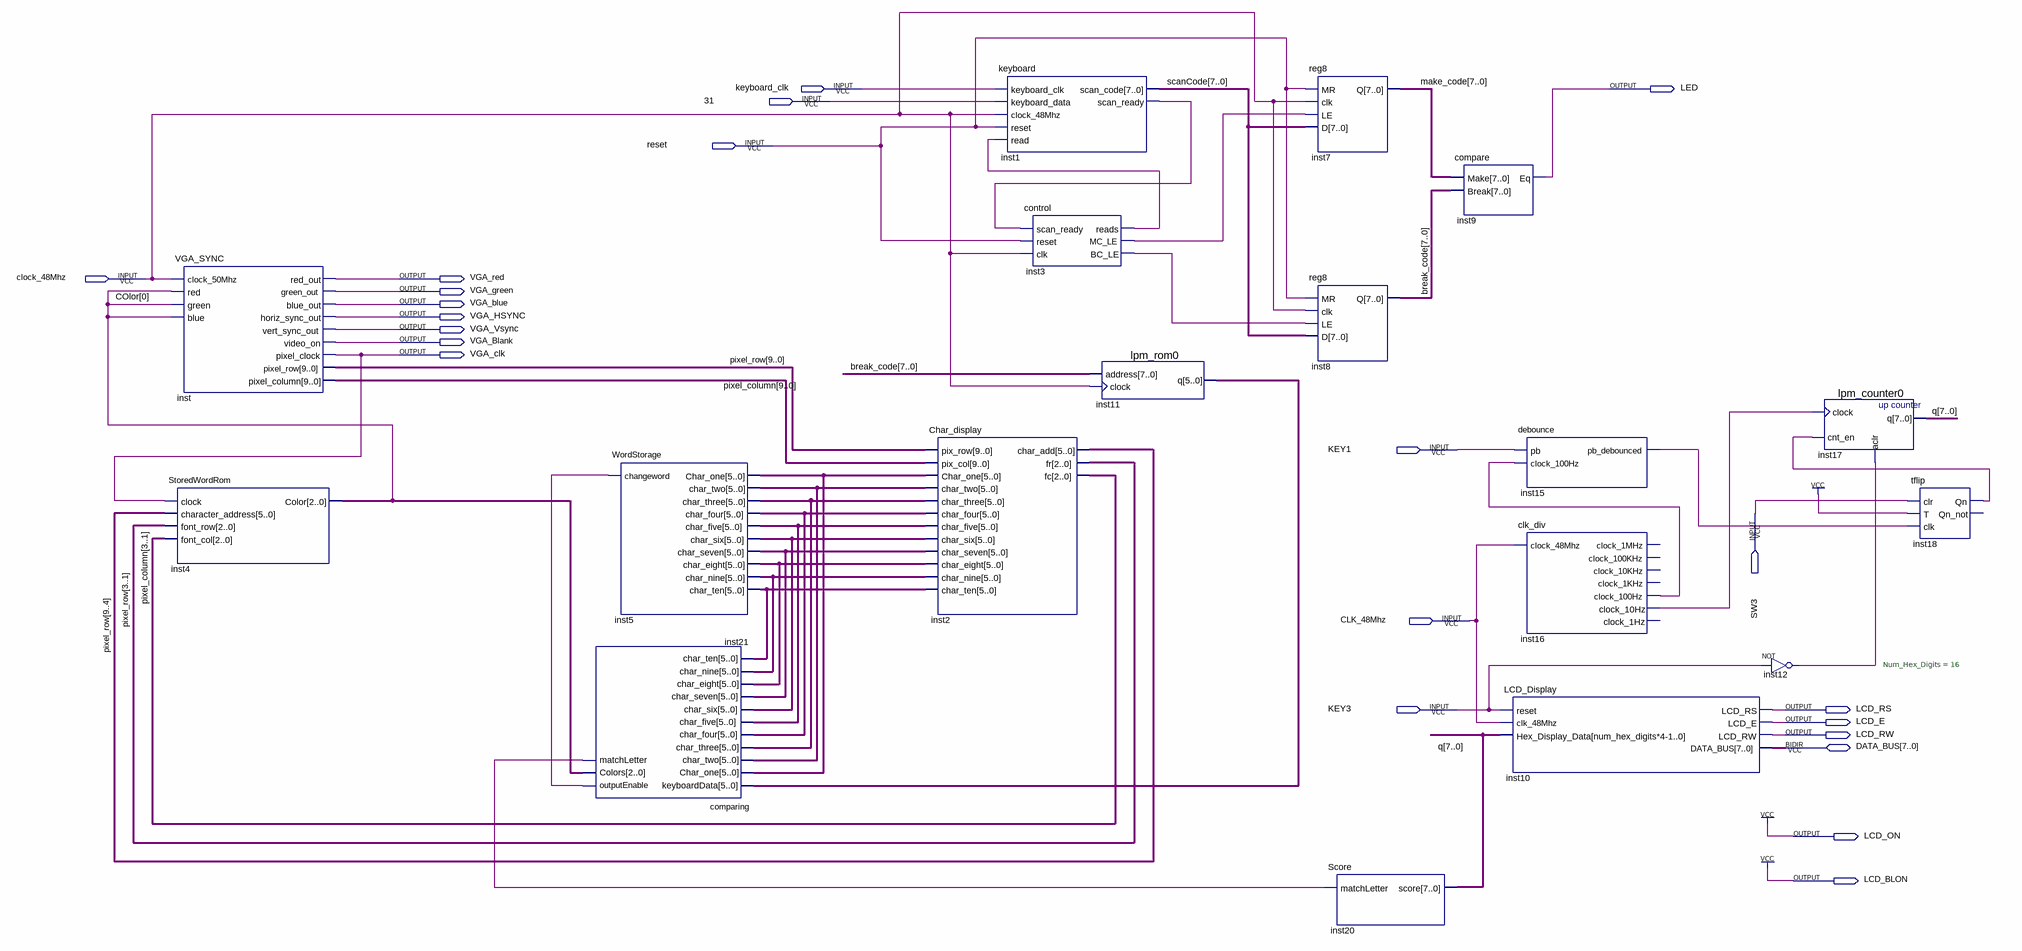
[diagram p0: schematic sheet]
// Quartus schematic overview(donotinclude).bdf as structural Verilog: 18 symbols, 22 pins
module \overview(donotinclude)  (
  input  keyboard_clk,
  input  \31 ,
  input  reset,
  input  clock_48Mhz,
  input  KEY1,
  input  SW3,
  input  CLK_48Mhz,
  input  KEY3,
  inout  [7:0] DATA_BUS,
  output LED,
  output VGA_red,
  output VGA_green,
  output VGA_blue,
  output VGA_HSYNC,
  output VGA_Vsync,
  output VGA_Blank,
  output VGA_clk,
  output LCD_RS,
  output LCD_E,
  output LCD_RW,
  output LCD_ON,
  output LCD_BLON
);

  wire inst1_scan_ready, inst3_bc_le, inst3_mc_le, inst3_reads, inst12_out, inst15_pb_debounced,
       inst16_clock_10hz, inst16_clock_100hz, inst18_qn, inst21_matchletter, inst21_outputenable;
  wire [0:0] COlor;
  wire [2:0] inst4_color;
  wire [5:0] inst5_char_eight, inst5_char_five, inst5_char_four, inst5_char_nine, inst5_char_one,
       inst5_char_seven, inst5_char_six, inst5_char_ten, inst5_char_three, inst5_char_two, inst11_q;
  wire [7:0] break_code, make_code, q, scanCode;
  wire [9:0] pixel_column, pixel_row;

  VGA_SYNC inst (
    .clock_50Mhz(clock_48Mhz), .red(COlor[0]), .green(COlor[0]), .blue(COlor[0]), .red_out(VGA_red),
    .green_out(VGA_green), .blue_out(VGA_blue), .horiz_sync_out(VGA_HSYNC), .vert_sync_out(VGA_Vsync),
    .video_on(VGA_Blank), .pixel_clock(VGA_clk), .pixel_row(pixel_row), .pixel_column(pixel_column));
  StoredWordRom inst4 (
    .clock(VGA_clk), .character_address(pixel_row[9:4]), .font_row(pixel_row[3:1]),
    .font_col(pixel_column[3:1]), .Color(inst4_color));
  WordStorage inst5 (
    .changeword(inst21_outputenable), .Char_one(inst5_char_one), .char_two(inst5_char_two),
    .char_three(inst5_char_three), .char_four(inst5_char_four), .char_five(inst5_char_five),
    .char_six(inst5_char_six), .char_seven(inst5_char_seven), .char_eight(inst5_char_eight),
    .char_nine(inst5_char_nine), .char_ten(inst5_char_ten));
  comparing inst21 (
    .keyboardData(inst11_q), .Char_one(inst5_char_one), .char_two(inst5_char_two),
    .char_three(inst5_char_three), .char_four(inst5_char_four), .char_five(inst5_char_five),
    .char_six(inst5_char_six), .char_seven(inst5_char_seven), .char_eight(inst5_char_eight),
    .char_nine(inst5_char_nine), .char_ten(inst5_char_ten), .outputEnable(inst21_outputenable),
    .Colors(inst4_color), .matchLetter(inst21_matchletter));
  Char_display inst2 (
    .pix_row(pixel_row), .pix_col(pixel_column), .Char_one(inst5_char_one), .char_two(inst5_char_two),
    .char_three(inst5_char_three), .char_four(inst5_char_four), .char_five(inst5_char_five),
    .char_six(inst5_char_six), .char_seven(inst5_char_seven), .char_eight(inst5_char_eight),
    .char_nine(inst5_char_nine), .char_ten(inst5_char_ten), .char_add(pixel_row[9:4]), .fr(pixel_row[3:1]),
    .fc(pixel_column[3:1]));
  keyboard inst1 (
    .keyboard_clk(keyboard_clk), .keyboard_data(\31 ), .clock_48Mhz(clock_48Mhz), .reset(reset),
    .read(inst3_reads), .scan_code(scanCode), .scan_ready(inst1_scan_ready));
  control inst3 (
    .scan_ready(inst1_scan_ready), .reset(reset), .clk(clock_48Mhz), .reads(inst3_reads),
    .MC_LE(inst3_mc_le), .BC_LE(inst3_bc_le));
  lpm_rom0 inst11 (.address(break_code), .clock(clock_48Mhz), .q(inst11_q));
  reg8 inst7 (.MR(reset), .clk(clock_48Mhz), .LE(inst3_mc_le), .D(scanCode), .Q(make_code));
  reg8 inst8 (.MR(reset), .clk(clock_48Mhz), .LE(inst3_bc_le), .D(scanCode), .Q(break_code));
  Score inst20 (.matchLetter(inst21_matchletter), .score(q));
  compare inst9 (.Make(make_code), .Break(break_code), .Eq(LED));
  debounce inst15 (.pb(KEY1), .clock_100Hz(inst16_clock_100hz), .pb_debounced(inst15_pb_debounced));
  clk_div inst16 (
    .clock_48Mhz(CLK_48Mhz), .clock_100Hz(inst16_clock_100hz), .clock_10Hz(inst16_clock_10hz));  // open: clock_1MHz, clock_100KHz, clock_10KHz, clock_1KHz, clock_1Hz
  LCD_Display #(.Num_Hex_Digits(16)) inst10 (
    .reset(KEY3), .clk_48Mhz(CLK_48Mhz), .Hex_Display_Data(q), .LCD_RS(LCD_RS), .LCD_E(LCD_E),
    .LCD_RW(LCD_RW), .DATA_BUS(DATA_BUS));
  not inst12 (inst12_out, KEY3);
  lpm_counter0 inst17 (.clock(inst16_clock_10hz), .cnt_en(inst18_qn), .aclr(inst12_out), .q(q));
  tflip inst18 (.clr(SW3), .T(1'b1), .clk(inst15_pb_debounced), .Qn(inst18_qn));  // open: Qn_not

  assign LCD_BLON = 1'b1;
  assign LCD_ON = 1'b1;
endmodule
